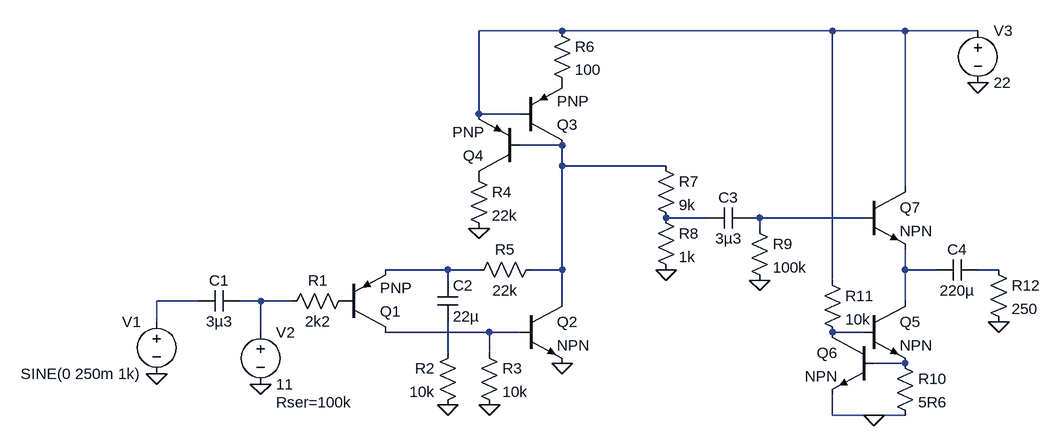
[diagram p0: schematic Draft1.asc]
Draft1.asc, the LTspice schematic file:
Version 4
SHEET 1 1240 680
WIRE 464 -336 336 -336
WIRE 880 -336 464 -336
WIRE 992 -336 880 -336
WIRE 1104 -336 992 -336
WIRE 336 -208 336 -336
WIRE 400 -208 336 -208
WIRE 464 -160 400 -160
WIRE 464 -128 464 -160
WIRE 624 -128 464 -128
WIRE 992 -96 992 -336
WIRE 688 -48 624 -48
WIRE 768 -48 752 -48
WIRE 928 -48 768 -48
WIRE 768 -32 768 -48
WIRE 288 32 192 32
WIRE 336 32 288 32
WIRE 464 32 464 -128
WIRE 464 32 416 32
WIRE 992 32 992 0
WIRE 1040 32 992 32
WIRE 1136 32 1104 32
WIRE 288 48 288 32
WIRE 880 48 880 -336
WIRE -96 80 -160 80
WIRE 0 80 -32 80
WIRE 48 80 0 80
WIRE 464 80 464 32
WIRE 992 80 992 32
WIRE -160 112 -160 80
WIRE 0 128 0 80
WIRE 352 128 192 128
WIRE 400 128 352 128
WIRE 928 128 880 128
WIRE 288 160 288 112
WIRE 352 160 352 128
WIRE 992 176 944 176
WIRE 880 256 880 224
WIRE 944 256 880 256
WIRE 992 256 944 256
FLAG -160 192 0
FLAG 0 208 0
FLAG 288 240 0
FLAG 352 240 0
FLAG 464 176 0
FLAG 336 -32 0
FLAG 624 32 0
FLAG 768 48 0
FLAG 944 256 0
FLAG 1136 112 0
FLAG 1104 -256 0
SYMBOL voltage -160 96 M0
WINDOW 123 0 0 Left 0
WINDOW 39 0 0 Left 0
SYMATTR InstName V1
SYMATTR Value SINE(0 250m 1k)
SYMBOL cap -32 64 R90
WINDOW 0 0 32 VBottom 2
WINDOW 3 32 32 VTop 2
SYMATTR InstName C1
SYMATTR Value 3µ3
SYMBOL voltage 0 112 R0
WINDOW 123 0 0 Left 0
WINDOW 39 24 124 Left 2
SYMATTR InstName V2
SYMATTR Value 11
SYMATTR SpiceLine Rser=100k
SYMBOL res 144 64 R90
WINDOW 0 0 56 VBottom 2
WINDOW 3 32 56 VTop 2
SYMATTR InstName R1
SYMATTR Value 2k2
SYMBOL pnp 128 128 M180
SYMATTR InstName Q1
SYMBOL cap 272 48 R0
SYMATTR InstName C2
SYMATTR Value 22µ
SYMBOL res 304 144 M0
SYMATTR InstName R2
SYMATTR Value 10k
SYMBOL res 336 144 R0
SYMATTR InstName R3
SYMATTR Value 10k
SYMBOL npn 400 80 R0
SYMATTR InstName Q2
SYMBOL pnp 400 -160 M180
SYMATTR InstName Q3
SYMBOL pnp 400 -112 R180
SYMATTR InstName Q4
SYMBOL res 320 -128 R0
SYMATTR InstName R4
SYMATTR Value 22k
SYMBOL res 432 16 R90
WINDOW 0 0 56 VBottom 2
WINDOW 3 32 56 VTop 2
SYMATTR InstName R5
SYMATTR Value 22k
SYMBOL res 448 -352 R0
SYMATTR InstName R6
SYMATTR Value 100
SYMBOL res 608 -144 R0
SYMATTR InstName R7
SYMATTR Value 9k
SYMBOL res 608 -64 R0
SYMATTR InstName R8
SYMATTR Value 1k
SYMBOL cap 752 -64 R90
WINDOW 0 0 32 VBottom 2
WINDOW 3 32 32 VTop 2
SYMATTR InstName C3
SYMATTR Value 3µ3
SYMBOL res 752 -48 R0
SYMATTR InstName R9
SYMATTR Value 100k
SYMBOL npn 928 80 R0
SYMATTR InstName Q5
SYMBOL npn 944 128 M0
SYMATTR InstName Q6
SYMBOL res 976 160 R0
SYMATTR InstName R10
SYMATTR Value 5R6
SYMBOL res 864 32 R0
SYMATTR InstName R11
SYMATTR Value 10k
SYMBOL npn 928 -96 R0
SYMATTR InstName Q7
SYMBOL cap 1104 16 R90
WINDOW 0 0 32 VBottom 2
WINDOW 3 32 32 VTop 2
SYMATTR InstName C4
SYMATTR Value 220µ
SYMBOL res 1120 16 R0
SYMATTR InstName R12
SYMATTR Value 250
SYMBOL voltage 1104 -352 R0
WINDOW 123 0 0 Left 0
WINDOW 39 0 0 Left 0
SYMATTR InstName V3
SYMATTR Value 22

The netlist it stands for:
* Draft1.asc
V1 N008 0 SINE(0 250m 1k)
C1 N009 N008 3µ3
V2 N009 0 11 Rser=100k
R1 P001 N009 2k2
Q1 N010 P001 N005 0 PNP
C2 N005 N012 22µ
R2 N012 0 10k
R3 N010 0 10k
Q2 N002 N010 0 0 NPN
Q3 N002 N001 P002 0 PNP
Q4 P003 N002 N001 0 PNP
R4 P003 0 22k
R5 N002 N005 22k
R6 N001 P002 100
R7 N002 N003 9k
R8 N003 0 1k
C3 N004 N003 3µ3
R9 N004 0 100k
Q5 N006 N011 N013 0 NPN
Q6 N011 N013 0 0 NPN
R10 N013 0 5R6
R11 N001 N011 10k
Q7 N001 N004 N006 0 NPN
C4 N007 N006 220µ
R12 N007 0 250
V3 N001 0 22
.model NPN NPN
.model PNP PNP
.lib standard.bjt
.backanno
.end